# EAGLE design driver motor (EAGLE 7.1.0)
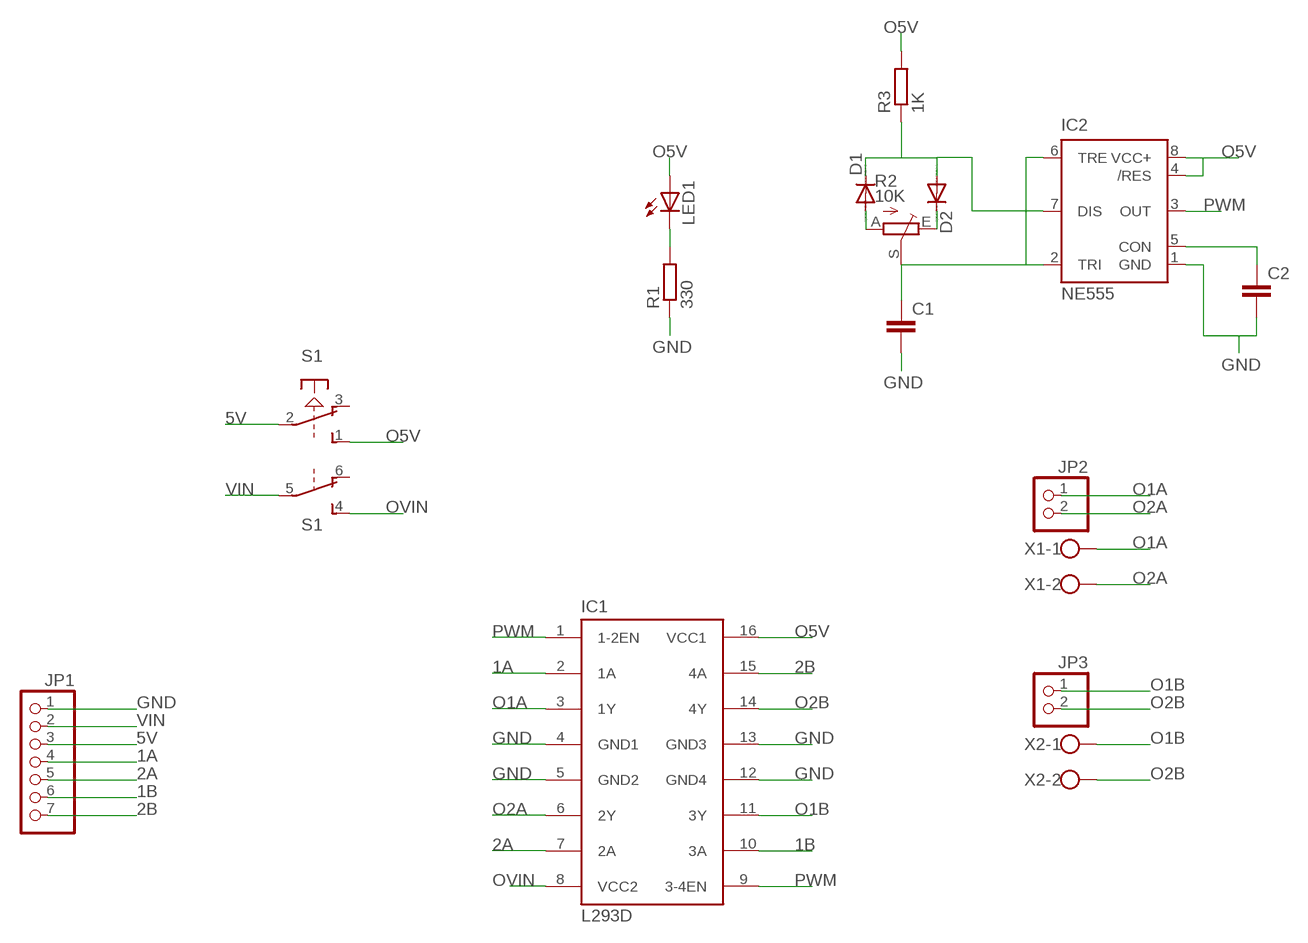
[diagram p0: schematic, sheet 1]

## Parts
C1  C-EU050-035X075  [C050-035X075]
C2  C-EU050-035X075  [C050-035X075]
D1  1N4148DO35-7  [DO35-7]
D2  1N4148DO35-7  [DO35-7]
IC1  L293D  [DIL16]
IC2  NE555  [DIL-08]
JP1  PINHD-1X7  [1X07]
JP2  PINHD-1X2  [1X02]
JP3  PINHD-1X2  [1X02]
LED1  LED3MM  [LED3MM]
R1  330  R-EU_0207/7  [0207/7]
R2  10K  TRIM_EU-CA6V  [CA6V]
R3  1K  R-EU_0207/7  [0207/7]
S1  PVA2R  [PVA2R]
X1  W237-102  [W237-102]
X2  W237-102  [W237-102]

## Nets
1A: IC1.2(1A) JP1.4
1B: IC1.10(3A) JP1.6
2A: IC1.7(2A) JP1.5
2B: IC1.15(4A) JP1.7
5V: JP1.3 S1.2(1:P)
GND: C1.2 C2.2 IC1.4(GND1) IC1.5(GND2) IC1.12(GND4) IC1.13(GND3) IC2.1(GND) JP1.1 R1.1
N$1: LED1.K(C) R1.2
N$2: C2.1 IC2.5(CON)
N$3: D1.C D2.A IC2.7(DIS) R3.1
N$4: D1.A R2.A
N$5: D2.C R2.E
N$7: C1.1 IC2.2(TRI) IC2.6(TRE) R2.S
O1A: IC1.3(1Y) JP2.1 X1.1
O1B: IC1.11(3Y) JP3.1 X2.1
O2A: IC1.6(2Y) JP2.2 X1.2
O2B: IC1.14(4Y) JP3.2 X2.2
O5V: IC1.16(VCC1) IC2.4(/RES) IC2.8(VCC+) LED1.A R3.2 S1.1(1:S)
OVIN: IC1.8(VCC2) S1.4(2:S)
PWM: IC1.1(1-2EN) IC1.9(3-4EN) IC2.3(OUT)
VIN: JP1.2 S1.5(2:P)
Unconnected: S1.3(1:O) S1.6(2:O)

## Library data of the parts
C1 C2 = rcl:C-EU: CAPACITOR, European symbol
D1 D2 = diode:1N4148: DIODE high speed (Philips)
IC1 = st-microelectronics:L293D: PUSH-PULL 4 CHANNEL DRIVER; MPN: L293D; OC_FARNELL: 9589619; OC_NEWARK: 56P8249
IC2 = st-microelectronics:NE555: General purpose bipolar Timer; MF: Arrow Electronics; MPN: NE555N; OC_FARNELL: 1467742; OC_NEWARK: 89K1486
JP1 = pinhead:PINHD-1X7: PIN HEADER
JP2 JP3 = pinhead:PINHD-1X2: PIN HEADER
LED1 = led:LED: LED OSRAM: - CHIPLED LG R971, LG N971, LY N971, LG Q971, LY Q971, LO R971, LY R971 LH N974, LH R974 LS Q976, LO Q976, LY Q976 LO Q996 - Hyper CHIPLED LW Q18S LB Q993, LB Q99A, LB R99A - SideLED LS A670, LO A670, LY A670, LG A670, LP A670 LB A673, LV A673, LT A673, LW A673 LH A674 LY A675 LS A676, LA A676, LO A676, LY A676, LW A676 LS A679, LY A679, LG A679 - Hyper Micro SIDELED® LS Y876, LA Y876, LO Y876, LY Y876 LT Y87S - SmartLED LW L88C, LW L88S LB L89C, LB L89S, LG L890 LS L89K, LO L89K, LY L89K LS L896, LA L896, LO L896, LY L896 - TOPLED LS T670, LO T670, LY T670, LG T670, LP T670 LSG T670, LSP T670, LSY T670, LOP T670, LYG T670 LG T671, LOG T671, LSG T671 LB T673, LV T673, LT T673, LW T673 LH T674 LS T676, LA T676, LO T676, LY T676, LB T676, LH T676, LSB T676, LW T676 LB T67C, LV T67C, LT T67C, LS T67K, LO T67K, LY T67K, LW E67C LS E67B, LA E67B, LO E67B, LY E67B, LB E67C, LV E67C, LT E67C LW T67C LS T679, LY T679, LG T679 LS T770, LO T770, LY T770, LG T770, LP T770 LB T773, LV T773, LT T773, LW T773 LH T774 LS E675, LA E675, LY E675, LS T675 LS T776, LA T776, LO T776, LY T776, LB T776 LHGB T686 LT T68C, LB T68C - Hyper Mini TOPLED® LB M676 - Mini TOPLED Santana® LG M470 LS M47K, LO M47K, LY M47K Source: http://www.osram.convergy.de LUXEON: - LUMILED® LXK2-PW12-R00, LXK2-PW12-S00, LXK2-PW14-U00, LXK2-PW14-V00 LXK2-PM12-R00, LXK2-PM12-S00, LXK2-PM14-U00 LXK2-PE12-Q00, LXK2-PE12-R00, LXK2-PE12-S00, LXK2-PE14-T00, LXK2-PE14-U00 LXK2-PB12-K00, LXK2-PB12-L00, LXK2-PB12-M00, LXK2-PB14-N00, LXK2-PB14-P00, LXK2-PB14-Q00 LXK2-PR12-L00, LXK2-PR12-M00, LXK2-PR14-Q00, LXK2-PR14-R00 LXK2-PD12-Q00, LXK2-PD12-R00, LXK2-PD12-S00 LXK2-PH12-R00, LXK2-PH12-S00 LXK2-PL12-P00, LXK2-PL12-Q00, LXK2-PL12-R00 Source: www.luxeon.com KINGBRIGHT: KA-3528ASYC Source: www.kingbright.com
R1 R3 = rcl:R-EU_: RESISTOR, European symbol
R2 = pot:TRIM_EU-: POTENTIOMETER
S1 = switch-misc:PVA2R: ITT SWITCH
X1 X2 = con-wago-500:W237-102: WAGO SCREW CLAMP; MPN: 237-102; OC_FARNELL: unknown; OC_NEWARK: 70K9898

## Board
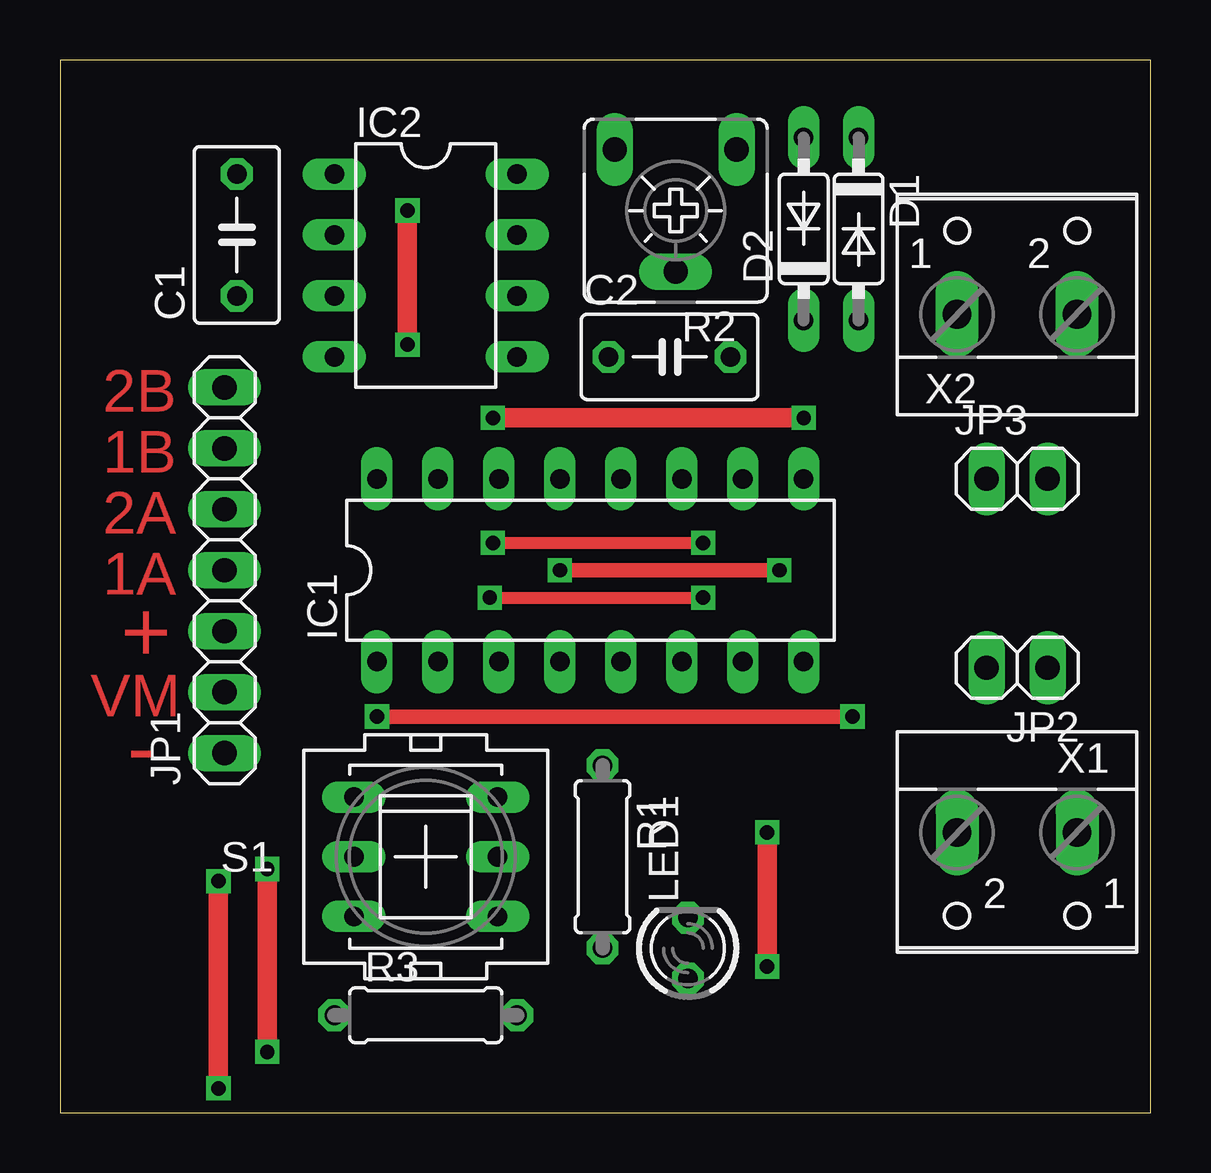
[diagram p1: board, top side]
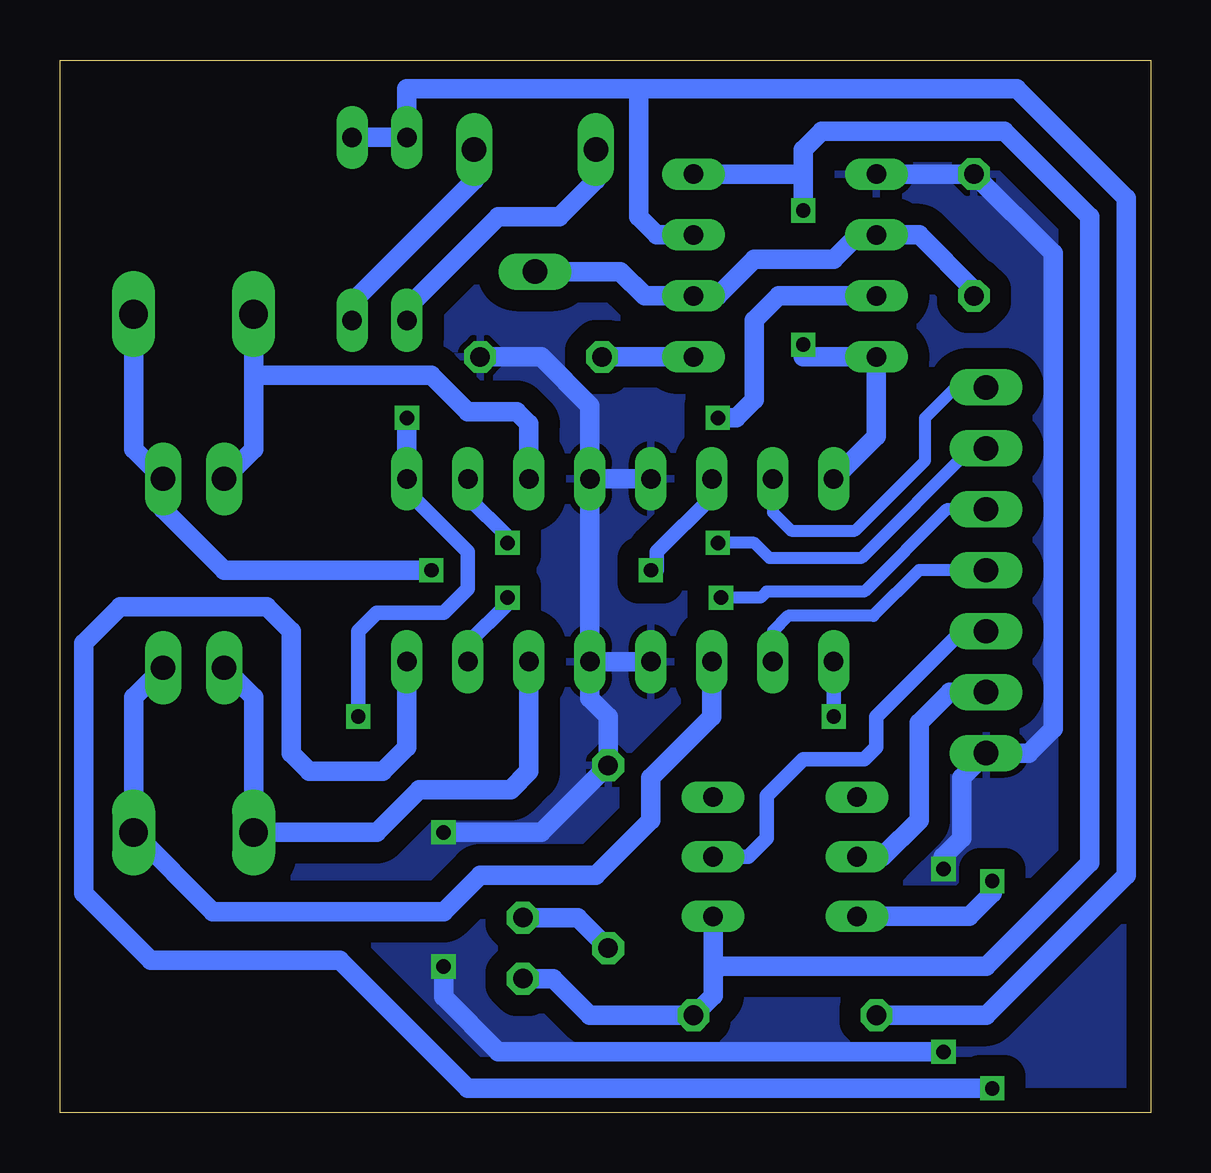
[diagram p2: board, bottom side, seen from below]

Size 45.45 x 43.87 mm. Coordinates in mm from the lower left corner, seen from the top.
Outline: 0,0 45.45,0 45.45,43.87 0,43.87 0,0
Copper layers (1*16): Top 0.035mm / dielectric 1.5mm / Bottom 0.035mm
Design rules "default *": minimum track width 10mil, minimum drill 24mil, track to track 35mil, track to pad 35mil, pad to pad 8mil, via to via 8mil, smd to smd 8mil, copper to edge 40mil, drill to drill 8mil, minimum pad ring 10mil, minimum via ring 8mil, stop-mask expansion 4mil, vias tented up to drill 0mil, thermal gap 10mil

### Footprints (pad centres in the part's own frame; a part is rotated, then mirrored left to right if it is on the bottom)
C050-035X075 = drill 0.813 octagon: 1 -2.54,0; 2 2.54,0
DO35-7 = drill 0.813 long: A 3.81,0; C -3.81,0
DIL16 = drill 0.813 long: 1 -8.89,-3.81; 2 -6.35,-3.81; 3 -3.81,-3.81; 4 -1.27,-3.81; 5 1.27,-3.81; 6 3.81,-3.81; 7 6.35,-3.81; 8 8.89,-3.81; 9 8.89,3.81; 10 6.35,3.81; 11 3.81,3.81; 12 1.27,3.81; 13 -1.27,3.81; 14 -3.81,3.81; 15 -6.35,3.81; 16 -8.89,3.81
DIL-08 = drill 0.813 long: 1 -3.81,-3.81; 2 -1.27,-3.81; 3 1.27,-3.81; 4 3.81,-3.81; 5 3.81,3.81; 6 1.27,3.81; 7 -1.27,3.81; 8 -3.81,3.81
1X07 = drill 1.016 long: 1 -7.62,0; 2 -5.08,0; 3 -2.54,0; 4 0,0; 5 2.54,0; 6 5.08,0; 7 7.62,0
1X02 = drill 1.016 long: 1 -1.27,0; 2 1.27,0
LED3MM = drill 0.813 octagon: A -1.27,0; K 1.27,0
0207/7 = drill 0.813 octagon: 1 -3.81,0; 2 3.81,0
CA6V = drill 1.016 long: A -2.54,-2.54; E 2.54,-2.54; S 0,2.54
PVA2R = drill 0.813 long: 1 -2.997,2.489; 2 -2.997,0; 3 -2.997,-2.489; 4 2.997,2.489; 5 2.997,0; 6 2.997,-2.489
W237-102 = drill 1.194 long: 1 -2.5,-1.27; 2 2.5,-1.27

### Placement (x,y rotation side)
C1  7.37,36.58 90 top
C2  25.4,31.5 0 top
D1  33.27,36.83 270 top
D2  30.99,36.83 90 top
IC1  22.1,22.61 0 top
IC2  15.24,35.31 270 top
JP1  6.86,22.61 90 top
JP2  39.88,18.54 180 top
JP3  39.88,26.42 0 top
LED1  26.16,6.86 90 top
R1  22.61,10.67 270 top
R2  25.65,37.59 180 top
R3  15.24,4.06 0 top
S1  15.24,10.67 180 top
X1  39.88,10.41 180 top
X2  39.88,34.54 0 top

### Tracks (layer width: path | path; a pad name or v marks a point on that pad's centre or on a via)
1A
  Bottom 0.508: JP1.4 9.65,22.61 11.56,20.7 15.11,20.7 15.75,20.07 IC1.2
1B  (via drill 0.6)
  Top 0.508: v18.03,23.75 v26.8,23.75
  Bottom 0.508: JP1.6 7.49,27.69 12.06,23.11 15.88,23.11 16.51,23.75 v18.03,23.75
  Bottom 0.61: IC1.10 28.45,25.65 26.8,24 v26.8,23.75
2A  (via drill 0.6)
  Top 0.508: v17.91,21.46 v26.8,21.46
  Bottom 0.508: JP1.5 8.51,25.15 11.94,21.72 16,21.72 16.26,21.46 v17.91,21.46
  Bottom 0.61: IC1.7 28.45,19.56 26.8,21.21 v26.8,21.46
2B
  Bottom 0.508: IC1.15 15.75,25.02 14.99,24.26 12.32,24.26 9.4,27.18 9.4,28.96 8.13,30.23 JP1.7
5V
  Bottom 0.61: JP1.3 7.87,20.07 11.43,16.51 11.43,15.24 11.94,14.73 14.48,14.73 16,13.21 16,11.43 16.76,10.67 S1.2
GND  (via drill 0.6)
  Top 0.813: v8.64,10.16 v8.64,2.54 | v29.46,6.1 v29.46,11.68
  Bottom 0.813: IC1.4 IC1.5 | v8.64,2.54 27.18,2.54 29.46,4.83 v29.46,6.1 | IC1.5 23.37,17.27 22.61,16.51 R1.1 25.4,11.68 v29.46,11.68 | v8.64,10.16 8.64,10.67 7.87,11.43 7.87,13.97 JP1.1 5.08,14.99 4.06,16 4.06,35.81 C1.2 IC2.1 | IC1.12 23.37,29.46 25.4,31.5 C2.2 | IC1.12 IC1.5 | IC1.13 IC1.12
  pour Bottom: 0,43.94 45.47,43.94 45.47,0 0,0
N$1
  Bottom 0.813: LED1.K 23.88,8.13 R1.2
N$2
  Bottom 0.813: IC2.5 C2.1
N$3
  Bottom 0.813: IC2.7 20.57,36.58 21.34,37.34 21.34,42.67 | R3.1 6.86,4.06 1.02,9.91 1.02,38.1 5.59,42.67 21.34,42.67 | D1.C D2.A 30.99,42.67 21.34,42.67
N$4
  Bottom 0.813: R2.A 28.19,38.86 33.27,33.78 D1.A
N$5
  Bottom 0.813: R2.E 23.11,38.86 24.64,37.34 27.18,37.34 30.99,33.53 D2.C
N$7
  Bottom 0.813: R2.S 22.1,35.05 21.08,34.04 IC2.6 18.03,34.04 16.51,35.56 13.21,35.56 12.19,36.58 IC2.2 9.65,36.58 7.37,34.29 C1.1
O1A
  Bottom 0.813: IC1.3 18.29,16.51 20.83,13.97 20.83,12.19 23.11,9.91 27.94,9.91 29.46,8.38 39.08,8.38 X1.1 42.38,17.31 JP2.1
O1B
  Bottom 0.813: X2.1 37.38,30.73 | 37.38,30.73 37.38,27.65 JP3.1 | IC1.11 25.91,28.7 26.42,29.21 28.45,29.21 29.97,30.73 37.38,30.73
O2A
  Bottom 0.813: IC1.6 25.91,14.22 26.67,13.46 30.48,13.46 32.26,11.68 X1.2 37.38,17.31 JP2.2
O2B  (via drill 0.6)
  Top 0.61: v20.83,22.61 v29.97,22.61
  Bottom 0.61: IC1.14 18.29,25.65 20.57,23.37 20.57,22.61 v20.83,22.61
  Bottom 0.813: v29.97,22.61 38.61,22.61 41.15,25.15 JP3.2 42.38,27.65 X2.2
O5V  (via drill 0.6)
  Top 0.813: v14.48,32 v14.48,37.59
  Bottom 0.813: IC1.16 11.43,28.19 IC2.4 14.48,31.5 v14.48,32 | IC2.8 14.48,39.12 | 14.48,39.12 v14.48,37.59 | 14.48,39.12 14.48,40.13 13.72,40.89 6.1,40.89 2.54,37.34 2.54,10.41 6.86,6.1 17.98,6.1 18.24,5.84 | LED1.A 24.89,5.59 23.37,4.06 R3.2 18.24,4.88 18.24,5.84 | S1.1 18.24,5.84
OVIN  (via drill 0.6)
  Top 0.813: v6.6,9.65 v6.6,1.02
  Bottom 0.813: IC1.8 30.99,15.24 32,14.22 35.05,14.22 35.81,14.99 35.81,20.07 36.83,21.08 42.93,21.08 44.45,19.56 44.45,9.14 41.66,6.35 33.78,6.35 28.45,1.02 v6.6,1.02 | S1.4 7.57,8.18 6.6,9.14 v6.6,9.65
PWM  (via drill 0.6)
  Top 0.61: v13.21,16.51 v33.02,16.51
  Top 0.813: v18.03,28.96 v30.99,28.96
  Bottom 0.61: IC1.1 v13.21,16.51 | v33.02,16.51 33.02,20.07 32.26,20.83 29.46,20.83 28.45,21.84 28.45,23.37 30.99,25.91 IC1.9
  Bottom 0.813: IC2.3 15.49,34.04 16.51,33.02 16.51,29.72 17.27,28.96 v18.03,28.96 | v30.99,28.96 IC1.9
VIN
  Bottom 0.813: S1.5 11.18,10.67 9.65,12.19 9.65,16.26 8.38,17.53 JP1.2

### Text on the board
Top: 2B | 1B | 2A | 1A | + | VM | -
tValues: 1N4148